# EAGLE schematic PGTNXEN_midi_inout (EAGLE 8.5.2)
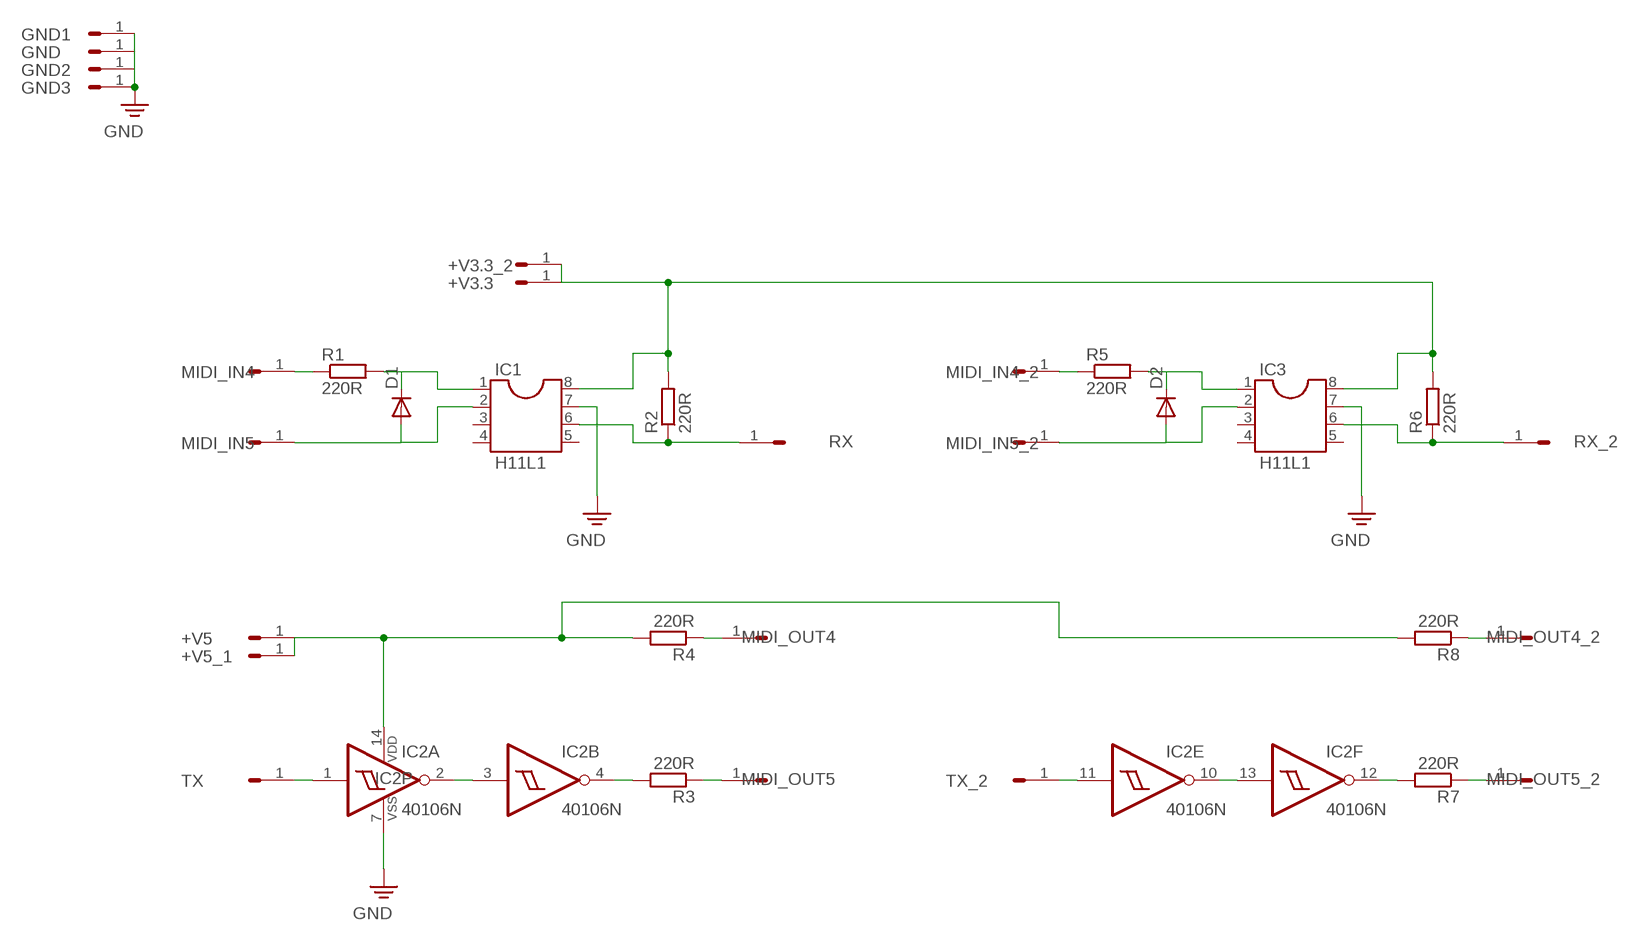
[diagram p0: schematic, sheet 1]

## Parts
+V3.3  HEADER/MALE/01  [HEADER/MALE/01]
+V3.3_2  HEADER/MALE/01  [HEADER/MALE/01]
+V5  HEADER/MALE/01  [HEADER/MALE/01]
+V5_1  HEADER/MALE/01  [HEADER/MALE/01]
D1  1N4148DO35-7  [DO35-7]
D2  1N4148DO35-7  [DO35-7]
GND  HEADER/MALE/01  [HEADER/MALE/01]
GND1  HEADER/MALE/01  [HEADER/MALE/01]
GND2  HEADER/MALE/01  [HEADER/MALE/01]
GND3  HEADER/MALE/01  [HEADER/MALE/01]
IC1  H11L1  DIL8  [DIL08]
IC2  40106N  [DIL14]
IC3  H11L1  DIL8  [DIL08]
MIDI_IN4  HEADER/MALE/01  [HEADER/MALE/01]
MIDI_IN4_2  HEADER/MALE/01  [HEADER/MALE/01]
MIDI_IN5  HEADER/MALE/01  [HEADER/MALE/01]
MIDI_IN5_2  HEADER/MALE/01  [HEADER/MALE/01]
MIDI_OUT4  HEADER/MALE/01  [HEADER/MALE/01]
MIDI_OUT4_2  HEADER/MALE/01  [HEADER/MALE/01]
MIDI_OUT5  HEADER/MALE/01  [HEADER/MALE/01]
MIDI_OUT5_2  HEADER/MALE/01  [HEADER/MALE/01]
R1  220R  RESISTORRESISTOR/UPRIGHT/7.5  [RESISTOR/7.5]
R2  220R  RESISTORRESISTOR/UPRIGHT/7.5  [RESISTOR/7.5]
R3  220R  RESISTORRESISTOR/UPRIGHT/7.5  [RESISTOR/7.5]
R4  220R  RESISTORRESISTOR/UPRIGHT/7.5  [RESISTOR/7.5]
R5  220R  RESISTORRESISTOR/UPRIGHT/7.5  [RESISTOR/7.5]
R6  220R  RESISTORRESISTOR/UPRIGHT/7.5  [RESISTOR/7.5]
R7  220R  RESISTORRESISTOR/UPRIGHT/7.5  [RESISTOR/7.5]
R8  220R  RESISTORRESISTOR/UPRIGHT/7.5  [RESISTOR/7.5]
RX  HEADER/MALE/01  [HEADER/MALE/01]
RX_2  HEADER/MALE/01  [HEADER/MALE/01]
TX  HEADER/MALE/01  [HEADER/MALE/01]
TX_2  HEADER/MALE/01  [HEADER/MALE/01]

## Nets
GND: GND1.1 GND2.1 GND3.1 GND.1 IC1.7 IC2.7(P:VSS) IC3.7
N$1: D1.C IC1.1 R1.2
N$2: MIDI_IN4.1 R1.1
N$3: D1.A IC1.2 MIDI_IN5.1
N$4: IC1.6 R2.1 RX.1
N$5: IC2.11(E:I) TX_2.1
N$6: IC2.1(A:I) TX.1
N$7: IC2.2(A:O) IC2.3(B:I)
N$8: IC2.4(B:O) R3.2
N$9: MIDI_OUT5.1 R3.1
N$11: MIDI_OUT4.1 R4.1
N$12: MIDI_IN4_2.1 R5.1
N$13: D2.C IC3.1 R5.2
N$14: D2.A IC3.2 MIDI_IN5_2.1
N$15: IC3.6 R6.1 RX_2.1
N$16: +V3.3.1 +V3.3_2.1 IC1.8 IC3.8 R2.2 R6.2
N$17: IC2.10(E:O) IC2.13(F:I)
N$18: IC2.12(F:O) R7.2
N$19: MIDI_OUT5_2.1 R7.1
N$20: +V5.1 +V5_1.1 IC2.14(P:VDD) R4.2 R8.2
N$21: MIDI_OUT4_2.1 R8.1
Unconnected: IC1.3 IC1.4 IC1.5 IC2.5(C:I) IC2.6(C:O) IC2.8(D:O) IC2.9(D:I) IC3.3 IC3.4 IC3.5

## Library data of the parts
+V3.3 +V3.3_2 +V5 +V5_1 GND GND1-GND3 MIDI_IN4 MIDI_IN4_2 MIDI_IN5 MIDI_IN5_2 MIDI_OUT4 MIDI_OUT4_2 MIDI_OUT5 MIDI_OUT5_2 RX RX_2 TX TX_2 = connectors:HEADER/MALE/01; SPICEPREFIX: X
D1 D2 = transistors:1N4148: DIODE high speed (Philips)
IC1 IC3 = ic_package:DIL8: Dual In Line / Socket
IC2 = 40xx:40106: Hex SCHMITT TRIGGER
R1-R8 = resistors:RESISTOR: RESISTOR, European symbol